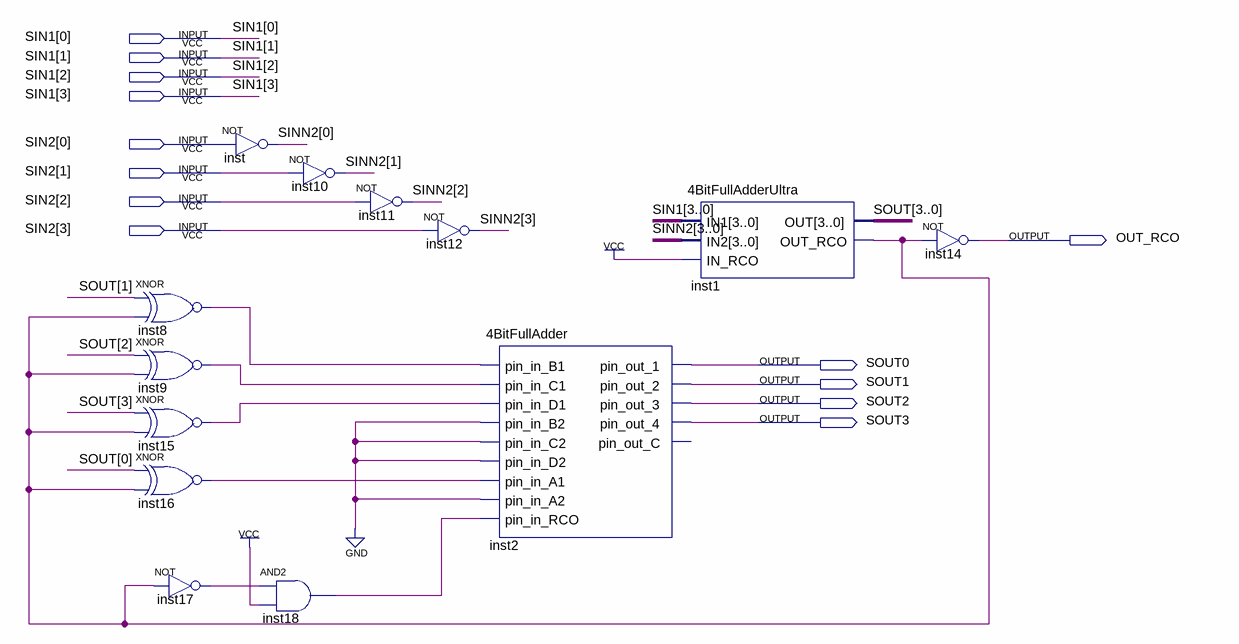
[diagram p0: schematic sheet]
// Quartus schematic 4BitFullSubtractor.bdf as structural Verilog: 13 symbols, 13 pins
module \4BitFullSubtractor  (
  input  [3:0] SIN1,
  input  [3:0] SIN2,
  output OUT_RCO,
  output SOUT0,
  output SOUT1,
  output SOUT2,
  output SOUT3
);

  wire inst1_out_rco, inst8_out, inst9_out, inst15_out, inst16_out, inst17_out, inst18_out;
  wire [3:0] SINN2;

  xnor inst8 (inst8_out, SOUT1, inst1_out_rco);
  xnor inst9 (inst9_out, SOUT2, inst1_out_rco);
  xnor inst15 (inst15_out, SOUT3, inst1_out_rco);
  xnor inst16 (inst16_out, SOUT0, inst1_out_rco);
  not inst (SINN2[0], SIN2[0]);
  not inst17 (inst17_out, inst1_out_rco);
  not inst10 (SINN2[1], SIN2[1]);
  and inst18 (inst18_out, inst17_out, 1'b1);
  not inst11 (SINN2[2], SIN2[2]);
  not inst12 (SINN2[3], SIN2[3]);
  \4BitFullAdder  inst2 (
    .pin_in_B1(inst8_out), .pin_in_C1(inst9_out), .pin_in_D1(inst15_out), .pin_in_B2(1'b0), .pin_in_C2(1'b0),
    .pin_in_D2(1'b0), .pin_in_A1(inst16_out), .pin_in_A2(1'b0), .pin_in_RCO(inst18_out), .pin_out_1(SOUT0),
    .pin_out_2(SOUT1), .pin_out_3(SOUT2), .pin_out_4(SOUT3));  // open: pin_out_C
  \4BitFullAdderUltra  inst1 (
    .IN1(SIN1), .IN2(SINN2), .IN_RCO(1'b1), .OUT({SOUT3, SOUT2, SOUT1, SOUT0}), .OUT_RCO(inst1_out_rco));
  not inst14 (OUT_RCO, inst1_out_rco);
endmodule
